# Altium project be_ca_thong_minh.PrjPcb
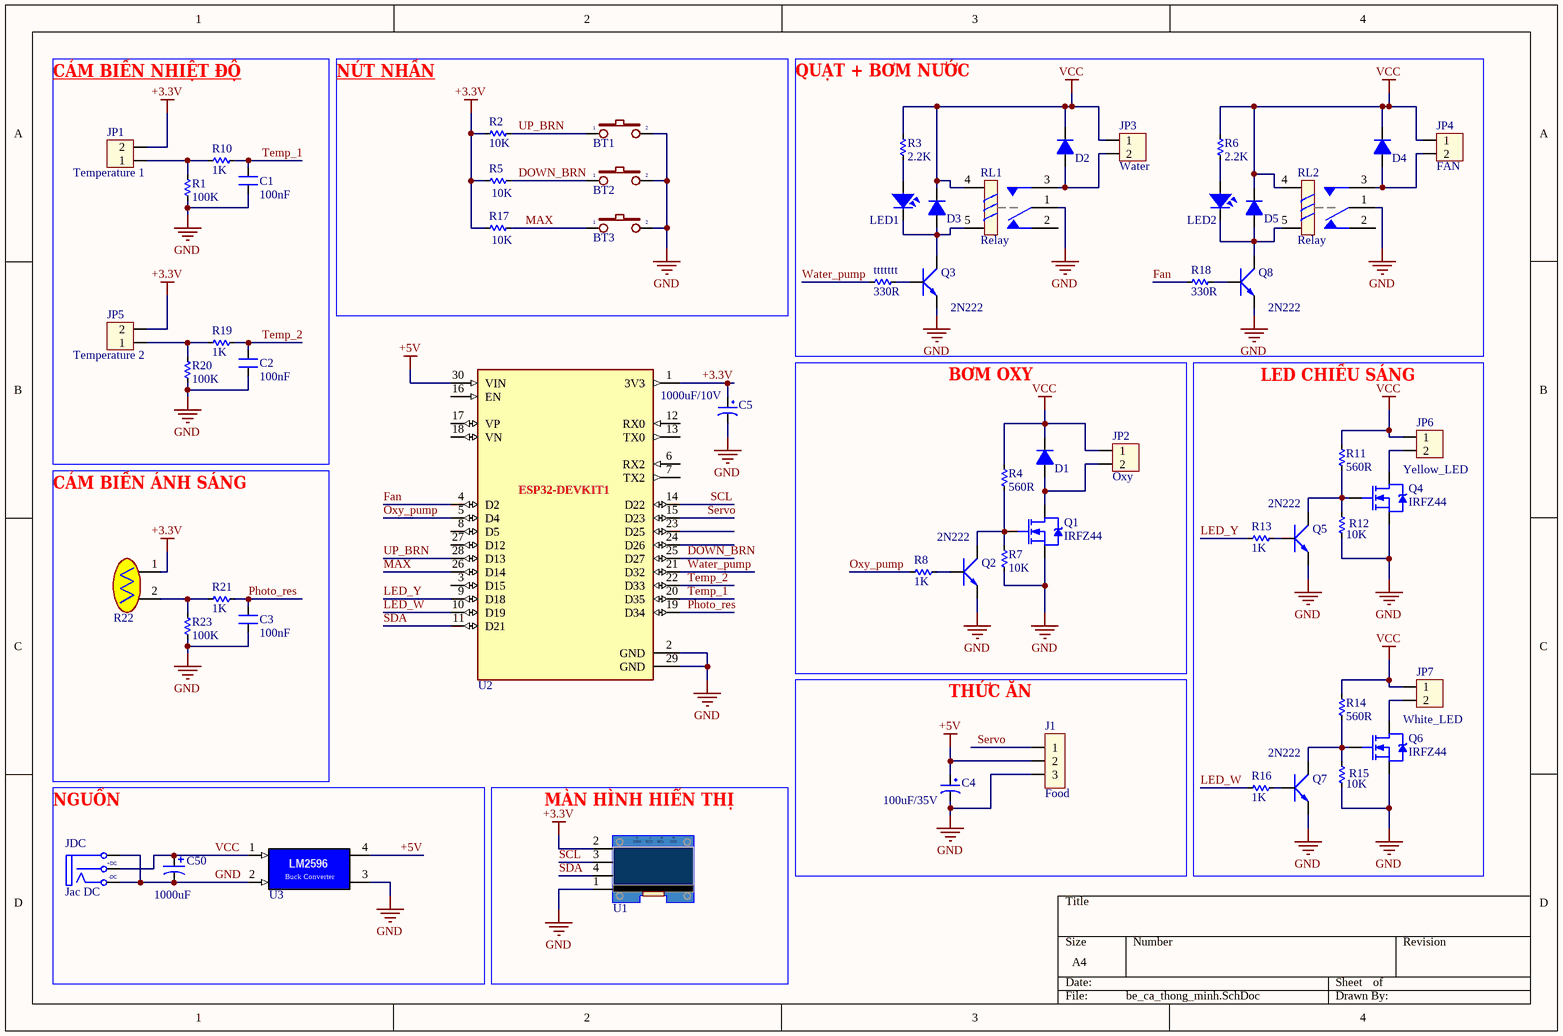
[diagram p0: be_ca_thong_minh.SchDoc]
1 sheet, 61 parts. Net scope: global (net labels, ports and power ports of the same name join across sheets).
Board file: be_ca_thong_minh.PcbDoc

## Sheet be_ca_thong_minh.SchDoc
size A4; SheetNumber: 1; SheetTotal: 1

### Parts
BT1  BUTTON1  [SW4]  (value not drawn)
BT2  BUTTON1  [SW4]  (value not drawn)
BT3  BUTTON1  [SW4]  (value not drawn)
C1  100nF  [CN2-O]
C2  100nF  [CN2-O]
C3  100nF  [CN2-O]
C4  100uF/35V  [CP1.5/3.4]
C5  1000uF/10V  [CP1.5/3.4]
C50  1000uF  [C8MM]
D1  Diode  1N4007  [DO41-1A]  (value not drawn)
D2  Diode  1N4007  [DO41-1A]  (value not drawn)
D3  Diode  1N4007  [DO41-1A]  (value not drawn)
D4  Diode  1N4007  [DO41-1A]  (value not drawn)
D5  Diode  1N4007  [DO41-1A]  (value not drawn)
J1  Food  [JP3]
JDC  Jac DC  [DC-IN]
JP1  Temperature 1  [CON2]
JP2  Oxy  [CON2]
JP3  Water  [CON2]
JP4  FAN  [CON2]
JP5  Temperature 2  [CON2]
JP6  Yellow_LED  [CON2]
JP7  White_LED  [CON2]
LED1  LED  [LED-5-BLUE]  (value not drawn)
LED2  LED  [LED-5-BLUE]  (value not drawn)
Q1  IRFZ44  [QTO-220H3]
Q2  2N222  [TO92-123 - 1]
Q3  2N222  [TO92-123 - 1]
Q4  IRFZ44  [QTO-220H3]
Q5  2N222  [TO92-123 - 1]
Q6  IRFZ44  [QTO-220H3]
Q7  2N222  [TO92-123 - 1]
Q8  2N222  [TO92-123 - 1]
R1  100K  [RES-1/4W]
R2  10K  [RES-SMD-0805]
R3  2.2K  [RES-1/4W]
R4  560R  [RES-1/4W]
R5  10K  [RES-SMD-0805]
R6  2.2K  [RES-1/4W]
R7  10K  [RES-1/4W]
R8  1K  [RES-1/4W]
R10  1K  [RES-1/4W]
R11  560R  [RES-1/4W]
R12  10K  [RES-1/4W]
R13  1K  [RES-1/4W]
R14  560R  [RES-1/4W]
R15  10K  [RES-1/4W]
R16  1K  [RES-1/4W]
R17  10K  [RES-SMD-0805]
R18  330R  [RES-1/4W]
R19  1K  [RES-1/4W]
R20  100K  [RES-1/4W]
R21  1K  [RES-1/4W]
R22  Photoresistor  [photoresistor]  (value not drawn)
R23  100K  [RES-1/4W]
RL1  Relay  [RL-05VDC-10A]
RL2  Relay  [RL-05VDC-10A]
ttttttt  330R  [RES-1/4W]
U1  Oled_0.96  [OLED_0.96_MODULE]  (value not drawn)
U2  ESP32-DEVKIT_V1  [32_DEVKIT_V1]  (value not drawn)
U3  LM2596_Module  [LM2596_Module]  (value not drawn)

### Nets
+3.3V: C5.1 JP1.2 JP5.2 R2.2 R5.2 R17.2 R22.1 U1.2 U2.1(3V3)
+5V: C4.1 J1.2 U2.30(VIN) U3.4
GND: BT1.2 BT2.2 BT3.2 C1.1 C2.1 C3.1 C4.2 C5.2 C50.2 J1.3 JDC.2(TN) JDC.3(S) Q1.3(S) Q2.1(E) Q3.1(E) Q4.3(S) Q5.1(E) Q6.3(S) Q7.1(E) Q8.1(E) R1.1 R7.2 R12.2 R15.2 R20.1 R23.1 RL1.1 RL2.1 U1.1 U2.2(GND) U2.29(GND) U3.2 U3.3
VCC: C50.1 D1.2 D2.2 D3.2 D4.2 D5.2 JDC.1(T) JP2.1 JP3.1 JP4.1 JP6.1 JP7.1 R3.2 R4.1 R6.2 R11.1 R14.1 RL1.4 RL2.4 U3.1
DOWN_BRN: BT2.1 R5.1 U2.25(D27)
Fan: R18.1 U2.4(D2)
LED_W: R16.1 U2.10(D19)
LED_Y: R13.1 U2.9(D18)
MAX: BT3.1 R17.1 U2.26(D14)
Oxy_pump: R8.1 U2.5(D4)
Photo_res: C3.2 R21.1 U2.19(D34)
SCL: U1.3 U2.14(D22)
SDA: U1.4 U2.11(D21)
Servo: J1.1 U2.15(D23)
Temp_1: C1.2 R10.1 U2.20(D35)
Temp_2: C2.2 R19.1 U2.22(D33)
UP_BRN: BT1.1 R2.1 U2.28(D13)
Water_pump: ttttttt.1 U2.21(D32)
NetD1_1: D1.1 JP2.2 Q1.2(D)
NetD2_1: D2.1 JP3.2 RL1.3
NetD3_1: D3.1 LED1.2 Q3.2(C) RL1.5
NetD4_1: D4.1 JP4.2 RL2.3
NetD5_1: D5.1 LED2.2 Q8.2(C) RL2.5
NetJP1_1: JP1.1 R1.2 R10.2
NetJP5_1: JP5.1 R19.2 R20.2
NetJP6_2: JP6.2 Q4.2(D)
NetJP7_2: JP7.2 Q6.2(D)
NetLED1_1: LED1.1 R3.1
NetLED2_1: LED2.1 R6.1
NetQ1_1: Q1.1(G) Q2.2(C) R4.2 R7.1
NetQ2_3: Q2.3(B) R8.2
NetQ3_3: Q3.3(B) ttttttt.2
NetQ4_1: Q4.1(G) Q5.2(C) R11.2 R12.1
NetQ5_3: Q5.3(B) R13.2
NetQ6_1: Q6.1(G) Q7.2(C) R14.2 R15.1
NetQ7_3: Q7.3(B) R16.2
NetQ8_3: Q8.3(B) R18.2
NetR21_2: R21.2 R22.2 R23.2

Not connected (* = marked no-connect by the designer): RL1 2; RL2 2; U2 3(D15) 6(RX2) 7(TX2) 8(D5) 12(RX0) 13(TX0) 16(EN) 17(VP) 18(VN) 23(D25) 24(D26) 27(D12)

### Notes on the sheet
- NÚT NHẤN
- QUẠT + BƠM NƯỚC
- CẢM BIẾN NHIỆT ĐỘ
- BƠM OXY
- CẢM BIẾN ÁNH SÁNG
- THỨC ĂN
- LED CHIẾU SÁNG
- NGUỒN
- (near U1) MÀN HÌNH HIỂN THỊ
- (in symbol DCIN) +DC; -DC
- (in symbol ESP32-DEVKIT_V1) ESP32-DEVKIT1
- (in symbol LM2596_Module) LM2596; Buck Converter
- (in symbol Oled_0.96) GND; VCC; SCL; SDA

### Library data of the parts
BT1-BT3 = BUTTON1: Value: 1N4007
C1-C3 = CAP-gom: Value: 33pF
C4 C5 = CP3: Cap 100uF/35V - 470uF/16V; Value: 100uF/35V/50V; Description 1: 1000uF/6,3V - 470uF/16V - 330uF - 25V; Description 2: 220uF/35V - 100uF/50V - 63V - 4,7uF/200V; Description 3: 22uF => 33uF100V - 3,3uF => 4,7uF/250V; Description 4: 2,2uF =>3,3uF/350 - 2,2uF/400V - 1uF/450V
C50 = CAP-Radial: Published: 8-Jun-2000; LatestRevisionDate: 17-Jul-2002; LatestRevisionNote: Re-released for DXP Platform.; PackageReference: POLAR0.8; Publisher: Altium Limited; value: ?
D1-D5 = Diode  1N4007: Diode 1A; Value: 1N4007
J1 = JP3: Value: J3
JDC = DCIN: Jac DC input; Value: Jac DC
JP1-JP7 = Con2: Connector 2; Value: Connector 2
LED1 LED2 = LED: LED Single colour Green and Red; Value: LED 3 ly Single Colour
Q1 Q4 Q6 = IRFZ44: HEXFET N-Channel Power MOSFET
Q2 Q3 Q5 Q7 Q8 = 2SC1815: NPN 600mW, ECB; Value: C1815
R1 R3 R4 R6-R8 R10-R16 R18-R21 R23 ttttttt = Res_DIP: Res; Manufacturer: Generic Components; Class: Passive; SubClass: R; Published: 08/06/2000; Publisher: Altium Hobart Technology Centre
R2 R5 R17 = Res-SMD: Resistor; Manufacturer: Generic Components; Class: Passive; Published: 08/06/2000; Publisher: Altium Hobart Technology Centre
RL1 RL2 = Relay 5VDC: Relay SPDT 5 Pin; Value: Relay SPDT, 10A, 12V
U2 = ESP32-DEVKIT_V1: The DOIT ESP32 DevKit V1 is probably the most famous development board based on the equally popular ESP32 Wi-Fi SoC from Espressif. In fact, the DevKit V1 is more popular than any official board from Espressif.